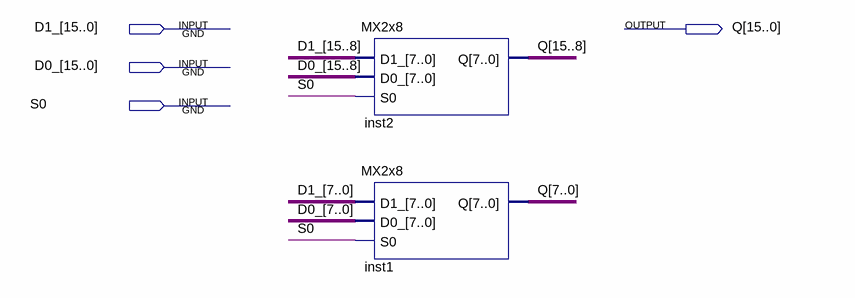
[diagram p0: schematic sheet]
// Quartus schematic MX2x16.bdf as structural Verilog: 2 symbols, 4 pins
module MX2x16 (
  input  [15:0] D1_,
  input  [15:0] D0_,
  input  S0,
  output [15:0] Q
);

  MX2x8 inst2 (.D1_(D1_[15:8]), .D0_(D0_[15:8]), .S0(S0), .Q(Q[15:8]));
  MX2x8 inst1 (.D1_(D1_[7:0]), .D0_(D0_[7:0]), .S0(S0), .Q(Q[7:0]));
endmodule
